# EAGLE schematic LM317 (EAGLE 9.6.2)
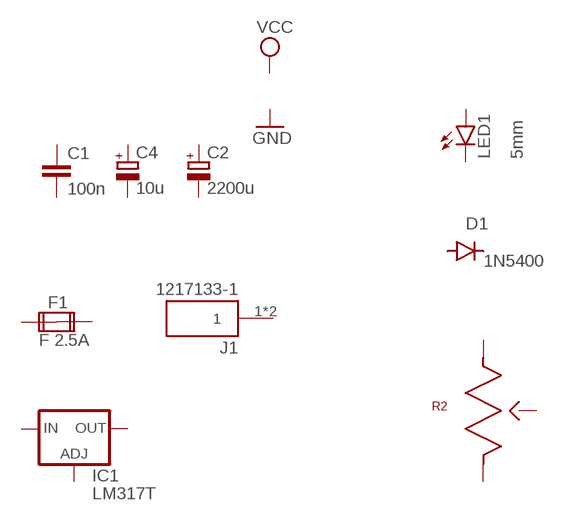
[diagram p0: schematic, sheet 1]

## Parts
C1  100n  C-EU102-043X133  [C102-043X133]
C2  2200u  CPOL-EUE35-18AXIAL  [E35-18]
C4  10u  CPOL-EUE15-6AXIAL  [E15-6]
D1  1N5400  [DO201-15]
F1  F 2.5A  FUSE2P  [FUSE1]
IC1  LM317T  LM317TS  [317TS]
J1  1217133-1  [TE_1217133-1]
LED1  5mm  LED5MM  [LED5MM]
R2  P160KN-0QC15B500K  [P160]
Unconnected: C1.1 C1.2 C2.+ C2.- C4.+ C4.- D1.A D1.C F1.1A F1.1B F1.2A F1.2B IC1.1(ADJ) IC1.2(OUT) IC1.3(IN) J1.1 J1.2 LED1.A LED1.K(C) R2.1 R2.2 R2.3

## Library data of the parts
C1 = rcl:C-EU: CAPACITOR, European symbol; SPICEPREFIX: C
C2 C4 = rcl:CPOL-EU: POLARIZED CAPACITOR, European symbol; SPICEPREFIX: C
D1 = diode:1N5400: DIODE standard rectifier, 3 A, 50 V (Motorola)
F1 = special:FUSE2P: FUSE 5 x 20 mm
IC1 = v-reg:LM317TS: VOLTAGE REGULATOR
J1 = 1217133-1:1217133-1: FASTON 187 PCB TAB TPBR Check prices <https://pricing.snapeda.com/parts/1217133-1/TE%20Connectivity/view-part?ref=eda>; AVAILABILITY: In Stock; COMMENT: 1217133-1; DESCRIPTION: FASTON 187 PCB TAB TPBR; EU_ROHS_COMPLIANCE: Compliant; MF: TE Connectivity; MP: 1217133-1; PACKAGE: None; PRICE: None; PURCHASE-URL: https://pricing.snapeda.com/search/part/1217133-1/?ref=eda
LED1 = led:LED: LED OSRAM: - CHIPLED LG R971, LG N971, LY N971, LG Q971, LY Q971, LO R971, LY R971 LH N974, LH R974 LS Q976, LO Q976, LY Q976 LO Q996 - Hyper CHIPLED LW Q18S LB Q993, LB Q99A, LB R99A - SideLED LS A670, LO A670, LY A670, LG A670, LP A670 LB A673, LV A673, LT A673, LW A673 LH A674 LY A675 LS A676, LA A676, LO A676, LY A676, LW A676 LS A679, LY A679, LG A679 - Hyper Micro SIDELED® LS Y876, LA Y876, LO Y876, LY Y876 LT Y87S - SmartLED LW L88C, LW L88S LB L89C, LB L89S, LG L890 LS L89K, LO L89K, LY L89K LS L896, LA L896, LO L896, LY L896 - TOPLED LS T670, LO T670, LY T670, LG T670, LP T670 LSG T670, LSP T670, LSY T670, LOP T670, LYG T670 LG T671, LOG T671, LSG T671 LB T673, LV T673, LT T673, LW T673 LH T674 LS T676, LA T676, LO T676, LY T676, LB T676, LH T676, LSB T676, LW T676 LB T67C, LV T67C, LT T67C, LS T67K, LO T67K, LY T67K, LW E67C LS E67B, LA E67B, LO E67B, LY E67B, LB E67C, LV E67C, LT E67C LW T67C LS T679, LY T679, LG T679 LS T770, LO T770, LY T770, LG T770, LP T770 LB T773, LV T773, LT T773, LW T773 LH T774 LS E675, LA E675, LY E675, LS T675 LS T776, LA T776, LO T776, LY T776, LB T776 LHGB T686 LT T68C, LB T68C - Hyper Mini TOPLED® LB M676 - Mini TOPLED Santana® LG M470 LS M47K, LO M47K, LY M47K Source: http://www.osram.convergy.de LUXEON: - LUMILED® LXK2-PW12-R00, LXK2-PW12-S00, LXK2-PW14-U00, LXK2-PW14-V00 LXK2-PM12-R00, LXK2-PM12-S00, LXK2-PM14-U00 LXK2-PE12-Q00, LXK2-PE12-R00, LXK2-PE12-S00, LXK2-PE14-T00, LXK2-PE14-U00 LXK2-PB12-K00, LXK2-PB12-L00, LXK2-PB12-M00, LXK2-PB14-N00, LXK2-PB14-P00, LXK2-PB14-Q00 LXK2-PR12-L00, LXK2-PR12-M00, LXK2-PR14-Q00, LXK2-PR14-R00 LXK2-PD12-Q00, LXK2-PD12-R00, LXK2-PD12-S00 LXK2-PH12-R00, LXK2-PH12-S00 LXK2-PL12-P00, LXK2-PL12-Q00, LXK2-PL12-R00 Source: www.luxeon.com KINGBRIGHT: KA-3528ASYC Source: www.kingbright.com
R2 = P160KN-0QC15B500K:P160KN-0QC15B500K: 500k Ohm 1 Gang Linear Panel Mount Potentiometer None 1 Turn Conductive Plastic 0.2W, 1/5W PC Pins Check prices <https://pricing.snapeda.com/parts/P160KN-0QC15B500K/BI%20Technologies%20%28TT%20electronics%29/view-part?ref=eda>; AVAILABILITY: In Stock; DESCRIPTION: Res Conductive Plastic POT 500K Ohm 20% 0.2W(1/5W) 1(Elec)/1(Mech)Turns 6mm (24.5 X 17 X 21mm) Pin Panel Mount/Through Hole Box/Tray; MF: BI Technologies (TT electronics); MP: P160KN-0QC15B500K; PACKAGE: None; PRICE: None; PURCHASE-URL: https://pricing.snapeda.com/search/part/P160KN-0QC15B500K/?ref=eda